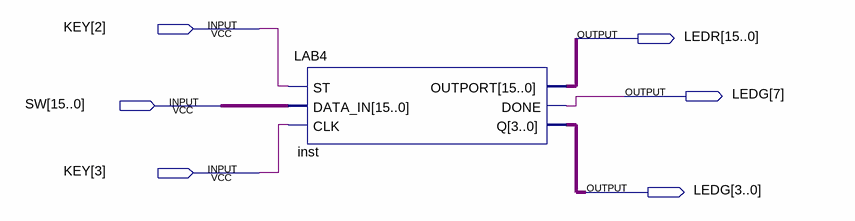
[diagram p0: schematic sheet]
// Quartus schematic KITDE2.bdf as structural Verilog: 1 symbols, 6 pins
module KITDE2 (
  input  [3:2] KEY,
  input  [15:0] SW,
  output [15:0] LEDR,
  output [7:0] LEDG
);

  LAB4 inst (.ST(KEY[2]), .DATA_IN(SW), .CLK(KEY[3]), .OUTPORT(LEDR), .DONE(LEDG[7]), .Q(LEDG[3:0]));
endmodule
